# Altium project _A_D.000000.001.PrjPCB
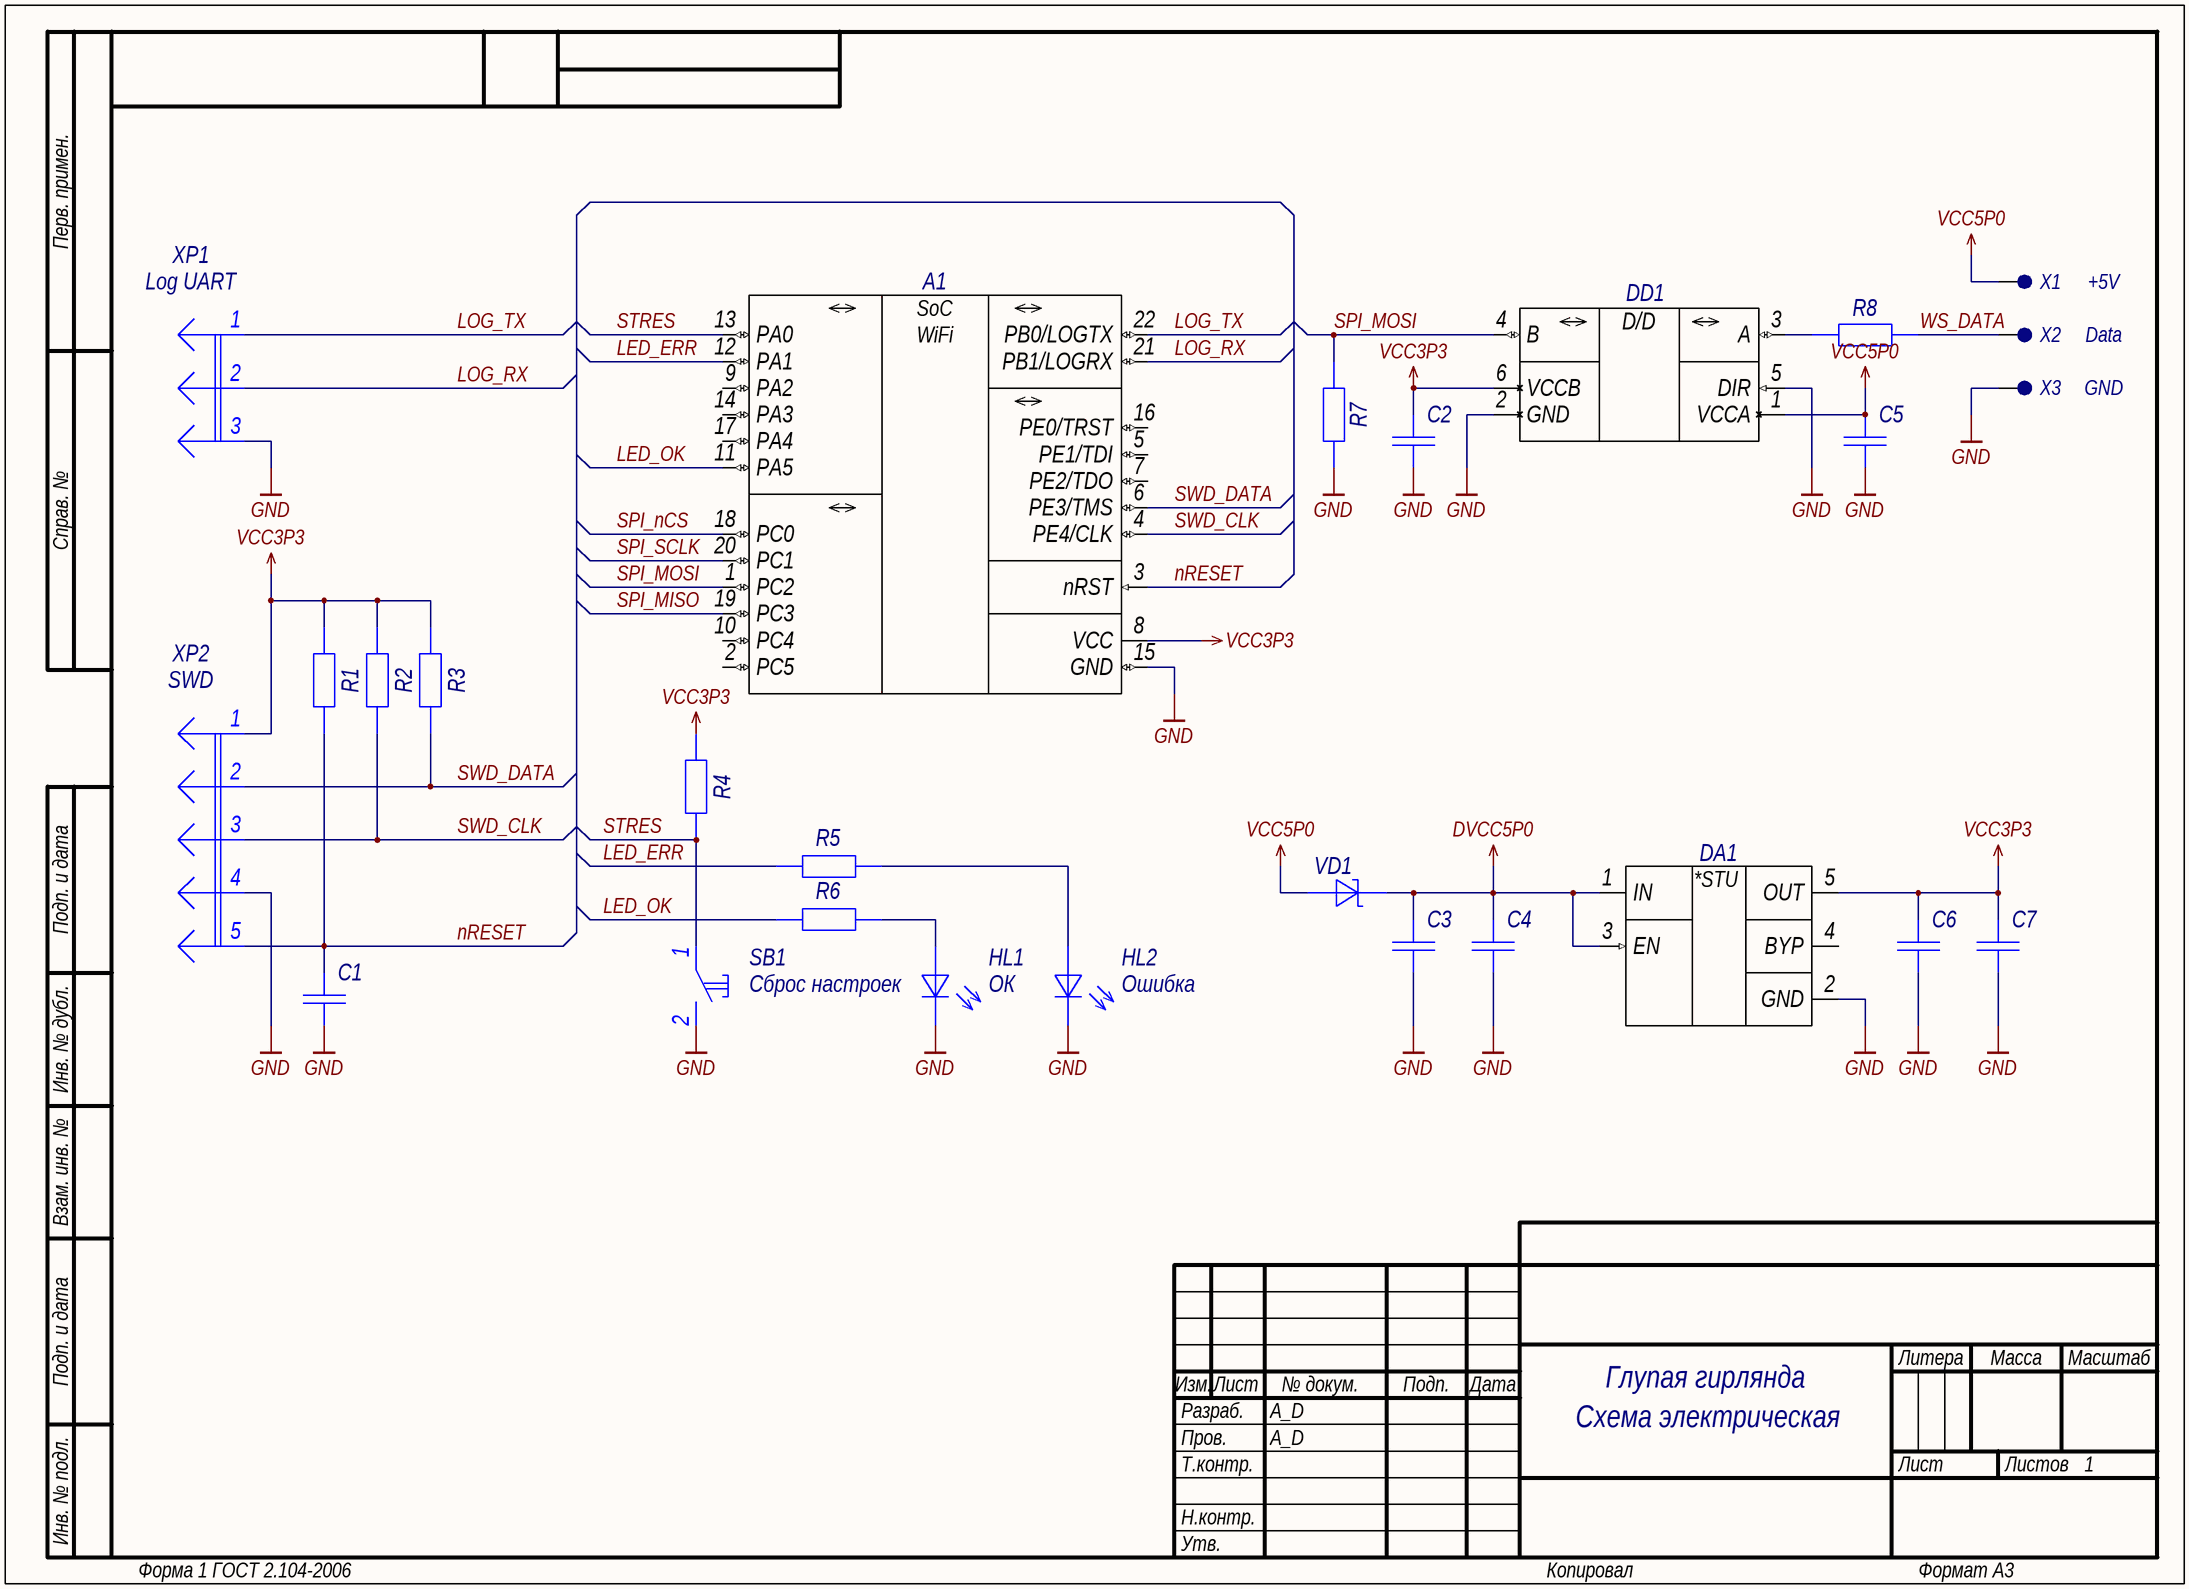
[diagram p0: A_D.000000.001.SchDoc]
GlobalOrganizationName: A_D Electronics; GlobalProjectName: Глупая гирлянда; GlobalProjectNumber: A_D.000000.001; GlobalProjectRevision: 0
1 sheet, 27 parts. Net scope: hierarchical (ports join the sheet entries above them; power ports are global).
Board file: A_D.000000.001.PcbDoc

## Sheet A_D.000000.001.SchDoc: =GlobalProjectName
size 410 x 297 mm; CheckedBy: A_D; Author: A_D; Organization: A_D Electronics; DocumentNumber: A_D.000000.001 Э3; Revision: 0; SheetTotal: 1; PageSetup: Record=PageOptions|CenterHorizontal=True|CenterVertical=True|PrintScale=0.70|XCorrection=1.00|YCorrection=1.00|PrintKind=2|BorderSize=5000000|LeftOffset=9000|BottomOffset=10100|Orientation=2|PaperLength=11176|PaperWidth=8636|Scale=100|PaperSource=259|PrintQuality=-3|MediaType=1|DitherType=10|PrintScaleMode=1|PaperKind=A3|PaperIndex=8; FirstApplication: A_D.000000.001; DocumentName: Глупая гирлянда

### Parts
A1  RTL-00_01  [RTL-00]  (value not drawn)
C1  Capacitor  [C0603]  (value not drawn)
C2  Capacitor  [C0603]  (value not drawn)
C3  Capacitor  [C0805]  (value not drawn)
C4  Capacitor  [C0603]  (value not drawn)
C5  Capacitor  [C0603]  (value not drawn)
C6  Capacitor  [C0603]  (value not drawn)
C7  Capacitor  [C0805]  (value not drawn)
DA1  MIC5205-Series  [SOT-23-5]  (value not drawn)
DD1  SN74AVC1T45D  [SOT-23-6]  (value not drawn)
HL1  ОК  [LD0603_L]
HL2  Ошибка  [LD0603_L]
R1  Resistor  [R0603]  (value not drawn)
R2  Resistor  [R0603]  (value not drawn)
R3  Resistor  [R0603]  (value not drawn)
R4  Resistor  [R0603_L]  (value not drawn)
R5  Resistor  [R0603_L]  (value not drawn)
R6  Resistor  [R0603_L]  (value not drawn)
R7  Resistor  [R0603_L]  (value not drawn)
R8  Resistor  [R0603]  (value not drawn)
SB1  Сброс настроек  [SKQGABE010]
VD1  Schottky  [SOD-123]  (value not drawn)
X1  +5V  [SMDPad_4.0]  (no BOM)
X2  Data  [SMDPad_4.0]  (no BOM)
X3  GND  [SMDPad_4.0]  (no BOM)
XP1  Log UART  [PLS-3]
XP2  SWD  [PLS-5]

### Nets
DVCC5P0: C3.2 C4.2 DA1.1(IN) DA1.3(EN) VD1.2(К)
GND: A1.15(GND) C1.1 C2.1 C3.1 C4.1 C5.1 C6.1 C7.1 DA1.2(GND) DD1.2(GND) DD1.5(DIR) HL1.2(К) HL2.2(К) R7.1 SB1.2 X3.1 XP1.3 XP2.4
VCC3P3: A1.8(VCC) C2.2 C6.2 C7.2 DA1.5(OUT) DD1.6(VCCB) R1.2 R2.2 R3.2 R4.2 XP2.1
VCC5P0: C5.2 DD1.1(VCCA) VD1.1(А) X1.1
LED_ERR: A1.12(PA1) R5.1
LED_OK: A1.11(PA5) R6.1
LOG_RX: A1.21(PB1/LOGRX) XP1.2
LOG_TX: A1.22(PB0/LOGTX) XP1.1
nRESET: A1.3(nRST) C1.2 R1.1 XP2.5
SPI_MISO: A1.19(PC3)
SPI_MOSI: A1.1(PC2) DD1.4(B) R7.2
SPI_nCS: A1.18(PC0)
SPI_SCLK: A1.20(PC1)
STRES: A1.13(PA0) R4.1 SB1.1
SWD_CLK: A1.4(PE4/CLK) R2.1 XP2.3
SWD_DATA: A1.6(PE3/TMS) R3.1 XP2.2
WS_DATA: R8.2 X2.1
NetDD1_3: DD1.3(A) R8.1
NetHL1_1: HL1.1(А) R6.2
NetHL2_1: HL2.1(А) R5.2

Not connected (* = marked no-connect by the designer): A1 2(PC5) 5(PE1/TDI) 7(PE2/TDO) 9(PA2) 10(PC4) 14(PA3) 16(PE0/TRST) 17(PA4); DA1 4(BYP)

### Notes on the sheet
- Схема электрическая
  принципиальная
- Перв. примен.
- Справ. №
- Подп. и дата
- Инв. № дубл.
- Взам. инв. №
- Разраб.
- Изм.
- Лист
- № докум.
- Подп.
- Дата
- Литера
- Масса
- Масштаб
- Пров.
- Т.контр.
- Листов
- Инв. № подл.
- Н.контр.
- Утв.
- Форма 1 ГОСТ 2.104-2006
- Копировал
- Формат А3
- (in symbol MIC5205-3.3YM5) *STU
- (in symbol RTL-00) SoC; WiFi
- (in symbol SN74AVC1T45DBVR) D/D

### Library data of the parts
A1 = RTL-00: Manufacturer: B&T; ID: 1; Value: RTL-00; Supply Operation: +3.0…3.6V; Supply Current: 150mA; ROM/RAM: 1MB/512KB; Wireless Compatibility: 802.11 b/g/n; Supported Interfaces: JTAG, SWD, SPI, I2C, I2S, UART, PWM, PCM; I/O Lines: 19; Operation Frequency: 166MHz; Working Temperature Min: -20°С; Working Temperature Max: +85°С; Functional Analog: RTL-01, PADI-00, MJIOT-AMB-01S; Published: 12.12.2017; Publisher: Andrew Danich; Type: Модуль; Part Number: RTL-00; Application Category: 1
C1 C2 C4-C6 = GRM188R71C104KA01D: Manufacturer: Murata; Type: Конденсатор; ID: 131; Value: 0.1uF; Voltage: 16V; Tolerance: ±10%; Dielectric Type: X7R; Application Category: 1; Working Temperature Min: -55°С; Working Temperature Max: +125°С; Published: 18.05.2010; Publisher: Andrew Danich; Part Number: GRM188R71C104KA01D; Footprint: 0603
C3 C7 = GRM21BR60J226ME39L: Manufacturer: Murata; Type: Конденсатор; ID: 140; Value: 22uF; Voltage: 6.3V; Tolerance: ±20%; Dielectric Type: X5R; Application Category: 1; Working Temperature Min: -55°С; Working Temperature Max: +85°С; Published: 18.05.2010; Publisher: Andrew Danich; Part Number: GRM21BR60J226ME39L; Footprint: 0805
DA1 = MIC5205-3.3YM5: Manufacturer: Micrel; ID: 16; Input Voltage: +2.5…16V; Output Current: 150mA; Output Voltage: +3.3V; RMS Noise: 260nV; Temperature Stability: 40ppm/°C; Line Regulation: 0.05%/V; Application Category: 1; Working Temperature Min: -40°С; Working Temperature Max: +125°С; Functional Analog: MIC5205-3.3BM5; Published: 30.06.2017; Publisher: Andrew Danich; Type: Микросхема; Part Number: MIC5205-3.3YM5; Value: MIC5205-3.3YM5
DD1 = SN74AVC1T45DBVR: Manufacturer: Texas Instruments; ID: 5; Supply 1 Operation: +1.4…3.6V; Supply Current: 10uA; Directional: Bidirection; Channels: 1; Max Data Rate: 500Mbps; Working Temperature Min: -40°С; Working Temperature Max: +85°С; Functional Analog: SN74AVC1T45DBVT; Published: 26.03.2016; Publisher: Andrew Danich; Type: Микросхема; Part Number: SN74AVC1T45DBVR; Value: SN74AVC1T45DBVR; Supply 2 Operation: +1.4…3.6V; Application Category: 1
HL1 = BL-LS0603GC: Type: Индикатор единичный; ID: 14; Forward Voltage: 2.3V; Forward Current: 30mA; Power Dissipation: 65mW; Color: Green; Leds: 1; Published: 03.12.2013; Publisher: Andrew Danich; Part Number: BL-LS0603GC; Value: BL-LS0603GC; Footprint: 0603
HL2 = BL-LS0603HC: Type: Индикатор единичный; ID: 13; Forward Voltage: 2.2V; Forward Current: 30mA; Power Dissipation: 65mW; Color: Red; Leds: 1; Published: 03.12.2013; Publisher: Andrew Danich; Part Number: BL-LS0603HC; Value: BL-LS0603HC; Footprint: 0603
R1-R4 = RC0603JR-0710KL: Manufacturer: Yageo; ID: 12; Value: 10k; Limit Voltage: 50V; Tolerance: ±5%; Temperature Coefficient: 100ppm; Total Power Dissipation: 0.1W; Series Type: Thick-Film; Application Category: 1; Working Temperature Min: -55°С; Working Temperature Max: +155°С; Functional Analog: CR0603-JW-103E; Published: 24.03.2010; Publisher: Andrew Danich; Type: Резистор; Part Number: RC0603JR-0710KL; Footprint: 0603
R5 R6 = RC0603JR-07330RL: Manufacturer: Yageo; ID: 313; Value: 330; Limit Voltage: 50V; Tolerance: ±5%; Temperature Coefficient: 100ppm; Total Power Dissipation: 0.1W; Series Type: Thick-Film; Application Category: 1; Working Temperature Min: -55°С; Working Temperature Max: +155°С; Functional Analog: CR0603-JW-331E; Published: 24.03.2010; Publisher: Andrew Danich; Type: Резистор; Part Number: RC0603JR-07330RL; Footprint: 0603
R7 = RC0603JR-074K7L: Manufacturer: Yageo; ID: 56; Value: 4.7k; Limit Voltage: 50V; Tolerance: ±5%; Temperature Coefficient: 100ppm; Total Power Dissipation: 0.1W; Series Type: Thick-Film; Application Category: 1; Working Temperature Min: -55°С; Working Temperature Max: +155°С; Published: 24.03.2010; Publisher: Andrew Danich; Type: Резистор; Part Number: RC0603JR-074K7L; Footprint: 0603
R8 = RC0603JR-07100R: Manufacturer: Yageo; ID: 10; Value: 100; Limit Voltage: 50V; Tolerance: ±5%; Temperature Coefficient: 100ppm; Total Power Dissipation: 0.1W; Series Type: Thick-Film; Application Category: 1; Working Temperature Min: -55°С; Working Temperature Max: +155°С; Functional Analog: CR0603-JW-101E; Published: 24.03.2010; Publisher: Andrew Danich; Type: Резистор; Part Number: RC0603JR-07100R; Footprint: 0603
SB1 = SKQGABE010: Manufacturer: ALPS; ID: 30; Limit Voltage: 12V; Limit Current: 50mA; Backlight: NO; Number of Contacts: 4; Application Category: 1; Working Temperature Min: -20°С; Working Temperature Max: +70°С; Published: 17.04.2014; Publisher: Andrew Danich; Type: Переключатель; Part Number: SKQGABE010; Value: SKQGABE010; Height: 1.5mm
VD1 = SD103CW: Type: Диод; ID: 3; Reverse Voltage: 20V; Reverse Current: 5uA; Forward Voltage: 0.37V; Forward Current: 350mA; Total Power Dissipation: 400mW; Capacitance: 28pF; Max Operating Frequency: 10nS; Application Category: 1; Published: 18.05.2010; Publisher: Andrew Danich; Part Number: SD103CW; Value: SD103CW
X1-X3 = SMDPad: Type: Точка пайки
XP1 = PLS-3: ID: 2; Value: PLS-3; Limit Voltage: 250V; Limit Current: 3A; Connector Type: Male; Resistance: 15momh; Surface Finish: Gold; Pitch: 2.54mm; Published: 07.03.2013; Publisher: Andrew Danich; Type: Вилка; Part Number: PLS-3; Pins: 3
XP2 = PLS-5: Value: PLS-5; ID: 4; Limit Voltage: 250V; Limit Current: 3A; Connector Type: Male; Resistance: 15momh; Surface Finish: Gold; Pitch: 2.54mm; Published: 07.03.2013; Publisher: Andrew Danich; Type: Вилка; Part Number: PLS-5; Pins: 5